# EAGLE design MRA13 (EAGLE 6.5.0)
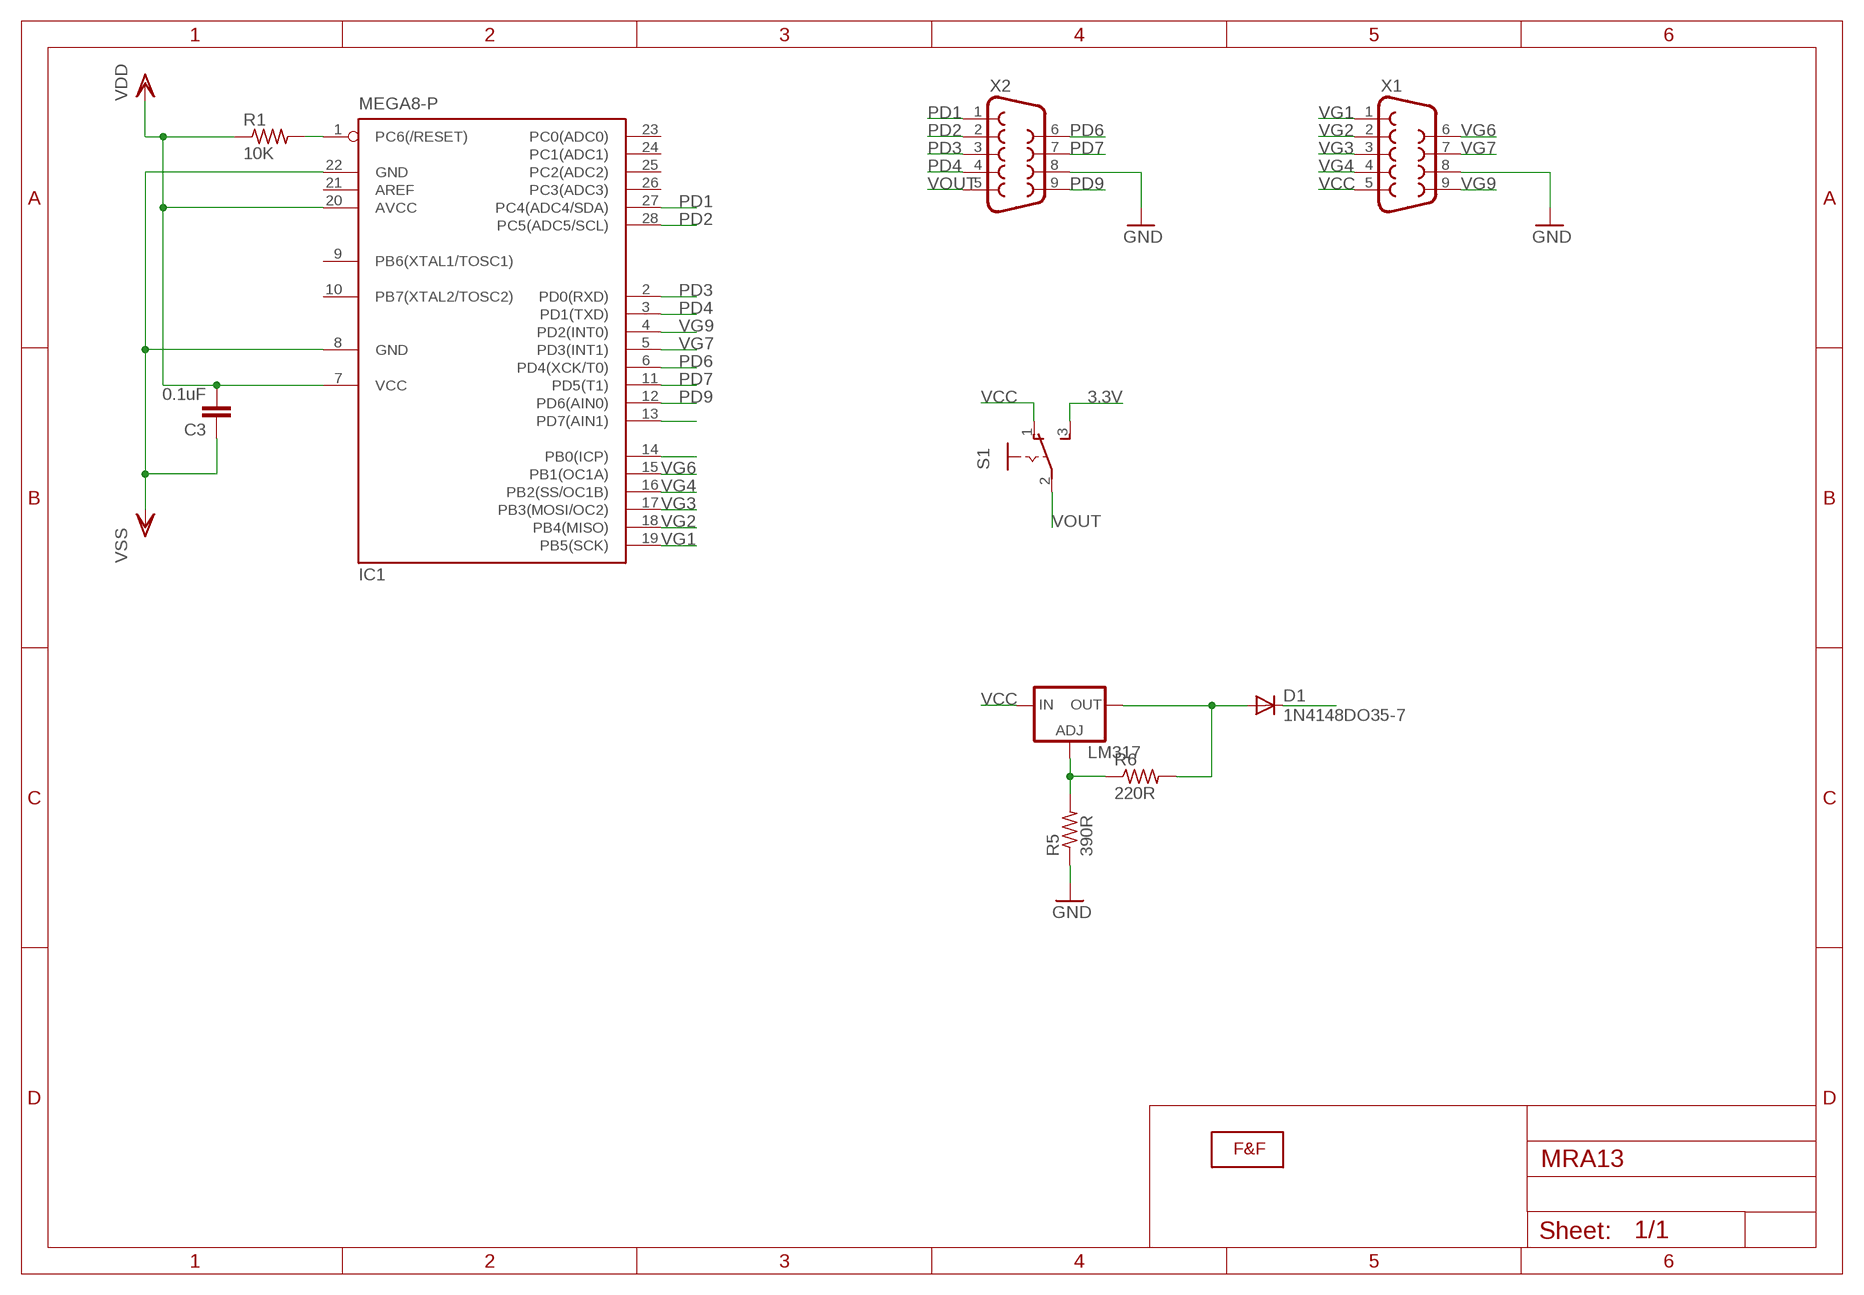
[diagram p0: schematic, sheet 1]

## Parts
C3  0.1uF  C-EU050-024X044  [C050-024X044]
D1  1N4148DO35-7  [DO35-7]
IC1  MEGA8-P  [DIL28-3]
LM317  LM317TS  [317TS]
R1  10K  R-US_0207/10  [0207/10]
R5  390R  R-US_0207/10  [0207/10]
R6  220R  R-US_0207/10  [0207/10]
S1  CHAVE  [CHAVE]
U$1  LOGOLOGO_WITHOUT_SMOKE_SMALL  [LOGO2_SMALL]
X1  DB9MALE  [DB9_MALE]
X2  DB9MALE  [DB9_MALE]

## Nets
3.3V: D1.C S1.3(S)
GND: C3.1 IC1.8(GND) IC1.22(GND) R5.1 X1.8 X2.8 ; supply symbol labelled VSS
N$1: IC1.1(PC6(/RESET)) R1.2
N$2: IC1.13(PD7(AIN1))
N$3: D1.A LM317.2(OUT) R6.2
N$4: IC1.14(PB0(ICP))
N$5: LM317.1(ADJ) R5.2 R6.1
PD1: IC1.27(PC4(ADC4/SDA)) X2.1
PD2: IC1.28(PC5(ADC5/SCL)) X2.2
PD3: IC1.2(PD0(RXD)) X2.3
PD4: IC1.3(PD1(TXD)) X2.4
PD6: IC1.6(PD4(XCK/T0)) X2.6
PD7: IC1.11(PD5(T1)) X2.7
PD9: IC1.12(PD6(AIN0)) X2.9
VCC: LM317.3(IN) S1.1(O) X1.5
VG1: IC1.19(PB5(SCK)) X1.1
VG2: IC1.18(PB4(MISO)) X1.2
VG3: IC1.17(PB3(MOSI/OC2)) X1.3
VG4: IC1.16(PB2(SS/OC1B)) X1.4
VG6: IC1.15(PB1(OC1A)) X1.6
VG7: IC1.5(PD3(INT1)) X1.7
VG9: IC1.4(PD2(INT0)) X1.9
VOUT: C3.2 IC1.7(VCC) IC1.20(AVCC) R1.1 S1.2(P) X2.5 ; supply symbol labelled VDD
Unconnected: IC1.9(PB6(XTAL1/TOSC1)) IC1.10(PB7(XTAL2/TOSC2)) IC1.21(AREF) IC1.23(PC0(ADC0)) IC1.24(PC1(ADC1)) IC1.25(PC2(ADC2)) IC1.26(PC3(ADC3))

## Library data of the parts
C3 = rcl:C-EU: CAPACITOR, European symbol
D1 = diode:1N4148: DIODE high speed (Philips)
IC1 = atmel:MEGA8-P: MICROCONTROLLER 8 Kbytes FLASH, 1 kbytes SRAM, 512 bytes EEPROM, USART, 4-channel 10 bit ADC, 2-channel 8 bit ADC Pin compatible with Atmega48, ATMega88, ATMega168 Source: avr.lbr; OC_FARNELL: unknown; OC_NEWARK: unknown
LM317 = v-reg:LM317TS: VOLTAGE REGULATOR
R1 R5 R6 = adafruit:R-US_: RESISTOR, American symbol
S1 = switch-fef:CHAVE: chave Verificar
U$1 = F&F:LOGO: Faísca e Fumaça Logo faiscaefumaca.com.br
X1 X2 = SparkFun:DB9: DB9 Connector Standard DB9 (D-Sub 9) serial connector. Can be used for CAN bus as well as RS485 and RS232. Footprint production proven. Spark Fun Electronics SKU : PRT-00429

## Board
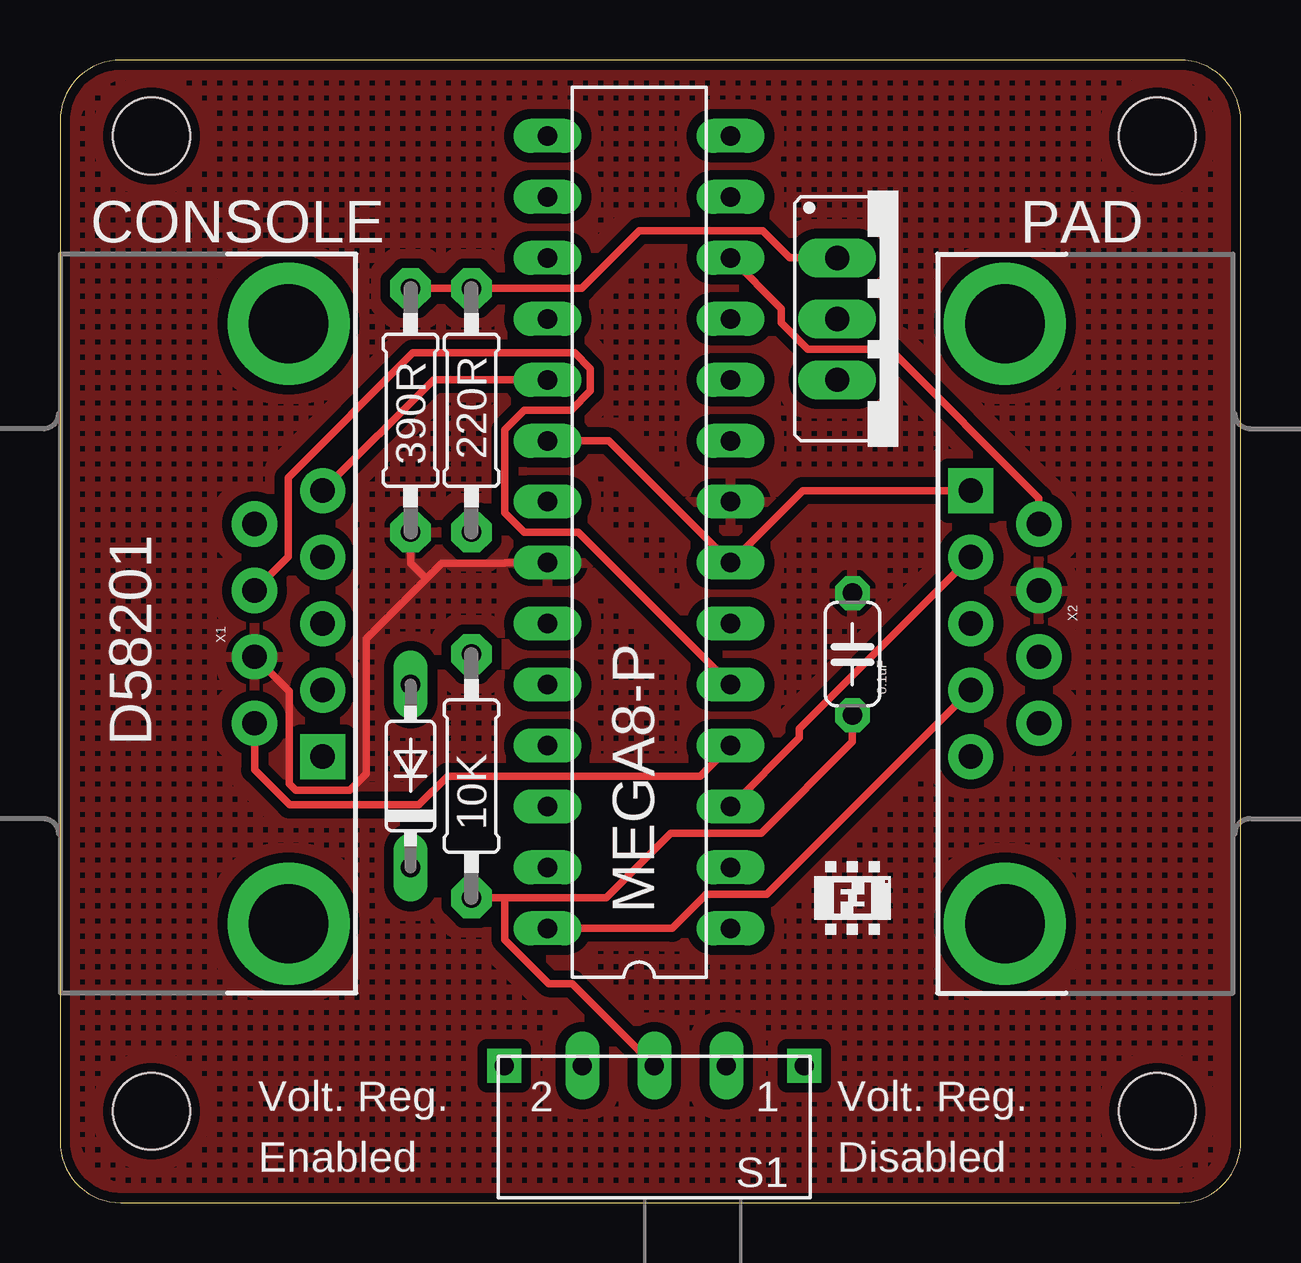
[diagram p1: board, top side]
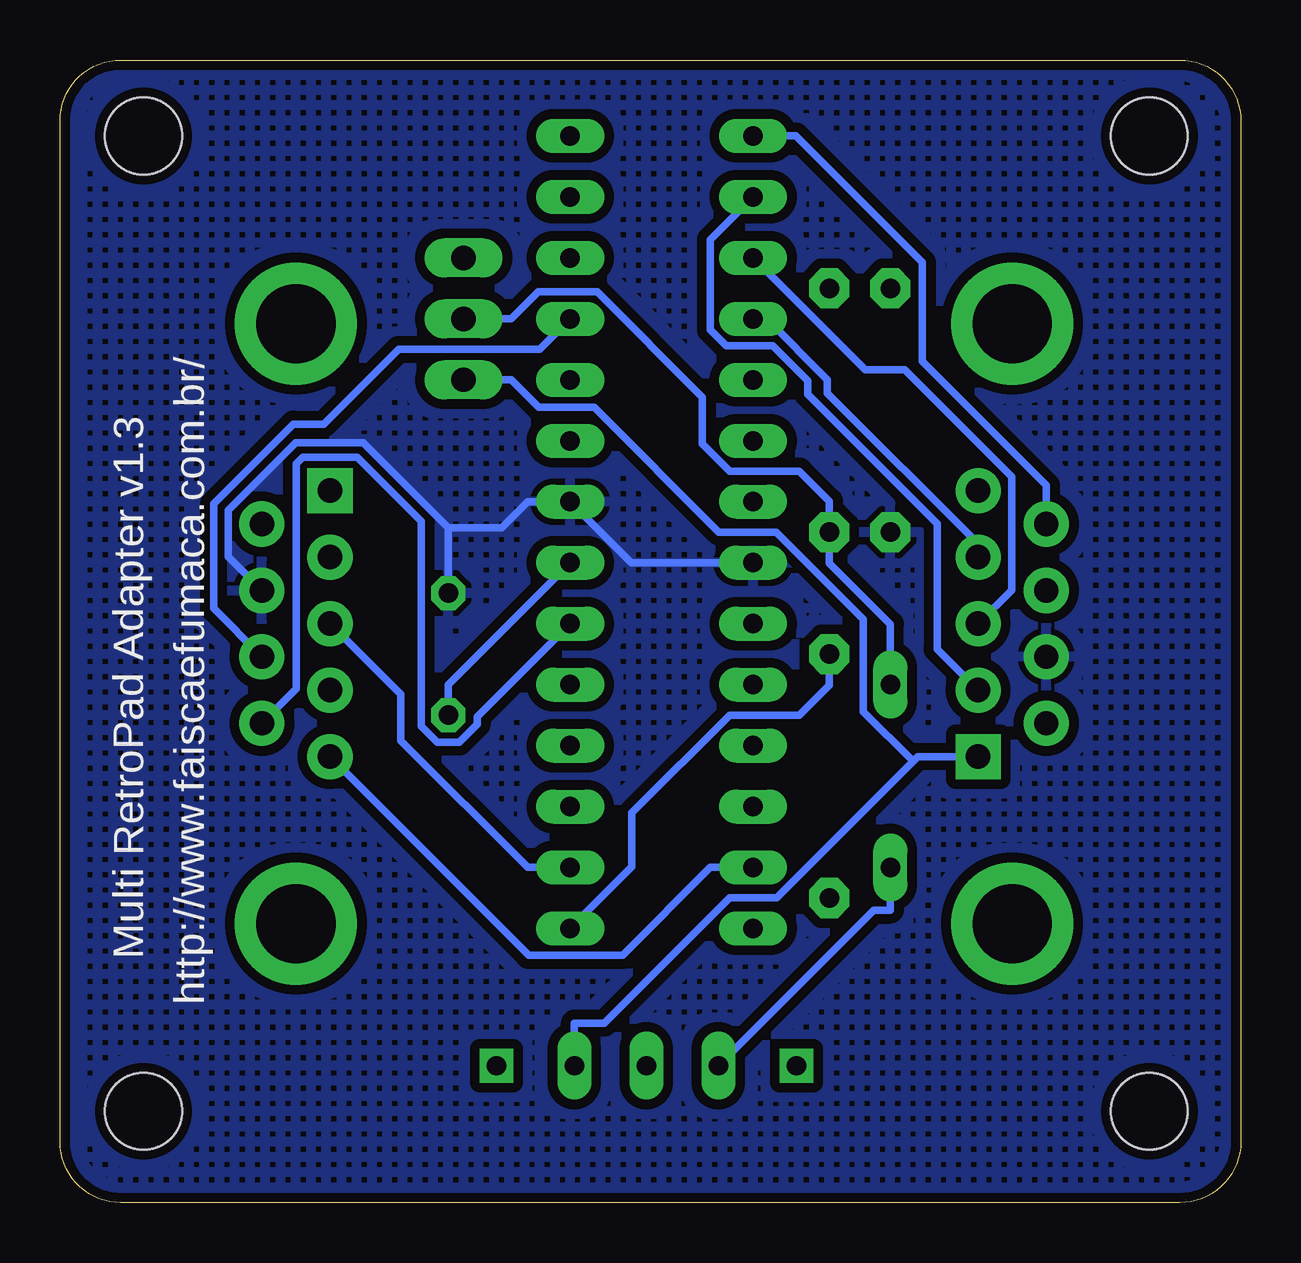
[diagram p2: board, bottom side, seen from below]

Size 49.2 x 47.62 mm. Coordinates in mm from the lower left corner, seen from the top.
Outline: 49.2,45.08 arc90 46.66,47.62 2.54,47.62 arc90 0,45.08 0,2.54 arc90 2.54,0 46.66,0 arc90 49.2,2.54 49.2,45.08
Copper layers (1*16): Top 0.035mm / dielectric 1.5mm / Bottom 0.035mm
Design rules "DFRobot_Eagle_Rule_v0.4": minimum track width 6mil, minimum drill 12mil, track to track 6mil, track to pad 6mil, pad to pad 6mil, via to via 6mil, smd to smd 0mil, copper to edge 10mil, drill to drill 10mil, minimum pad ring 12mil, minimum via ring 8mil, stop-mask expansion 2mil, vias tented up to drill 25mil, thermal gap 10mil
Holes 3.2 mm at 3.81,44.45 3.81,3.81 45.72,44.45 45.72,3.81

### Footprints (pad centres in the part's own frame; a part is rotated, then mirrored left to right if it is on the bottom)
C050-024X044 = drill 0.813 octagon: 1 -2.54,0; 2 2.54,0
DO35-7 = drill 0.813 long: A 3.81,0; C -3.81,0
DIL28-3 = drill 0.813 long: 1 -16.51,-3.81; 2 -13.97,-3.81; 3 -11.43,-3.81; 4 -8.89,-3.81; 5 -6.35,-3.81; 6 -3.81,-3.81; 7 -1.27,-3.81; 8 1.27,-3.81; 9 3.81,-3.81; 10 6.35,-3.81; 11 8.89,-3.81; 12 11.43,-3.81; 13 13.97,-3.81; 14 16.51,-3.81; 15 16.51,3.81; 16 13.97,3.81; 17 11.43,3.81; 18 8.89,3.81; 19 6.35,3.81; 20 3.81,3.81; 21 1.27,3.81; 22 -1.27,3.81; 23 -3.81,3.81; 24 -6.35,3.81; 25 -8.89,3.81; 26 -11.43,3.81; 27 -13.97,3.81; 28 -16.51,3.81
317TS = drill 1.016 long: 1 -2.54,-2.54; 2 0,-2.54; 3 2.54,-2.54
0207/10 = drill 0.813 pad 1.676 octagon: 1 -5.08,0; 2 5.08,0
CHAVE = drill 0.8 long: 1 -3,0; 2 0,0; 3 3,0 | drill 0.8 square: P$1 -6.25,0; P$2 6.25,0
DB9_MALE = drill 1.016 pad 1.88: 1 5.54,-1.42; 2 2.77,-1.42; 3 0,-1.42; 4 -2.77,-1.42; 6 4.15,1.42; 7 1.38,1.42; 8 -1.38,1.42; 9 -4.15,1.42 | drill 1.016 pad 1.88 square: 5 -5.54,-1.42 | drill 3.302 pad 5.08: G1 -12.5,0; G2 12.5,0

### Placement (x,y rotation side)
C3  33.02,22.86 270 top
D1  14.61,17.78 90 top
IC1  24.13,27.94 90 top
LM317  34.92,36.83 270 top
R1  17.14,17.78 90 top
R5  14.61,33.02 90 top
R6  17.14,33.02 270 top
S1  24.77,5.71 180 top
U$1  33.02,12.7 0 top
X1  9.53,24.13 90 top
X2  39.37,24.13 270 top

### Tracks (layer width: path | path; a pad name or v marks a point on that pad's centre or on a via)
3.3V
  Bottom 0.305: D1.C 14.61,12.19 15.29,12.19 S1.3 | S1.3 21.74,5.69 S1.3
GND
  Top 0.305: 15.25,26 12.76,23.5 12.76,17.87 12.08,17.19 9.81,17.19 9.55,17.46 9.55,21.31 X1.8 | X1.8 8.13,22.76 X1.8 | 15.25,26 15.9,26.64 18.52,26.64 18.54,26.67 IC1.22 | 15.25,26 14.61,26.64 R5.1
  Bottom 0.305: 33.02,28.13 C3.1 | 40.86,25.58 X2.8 40.84,25.6 40.86,25.58 | 40.86,25.58 42.19,26.91 42.19,28.86 39.37,31.68 36.56,31.68 33.02,28.13 | 33.02,28.13 30.8,28.13 29.72,29.21 IC1.8 25.4,26.67 IC1.22
  pour Top (isolate 0.406, hatched): 0,48.26 49.53,48.26 49.53,0 0,0
  pour Bottom (isolate 0.406, hatched): 0,48.26 49.53,48.26 49.53,0 0,0
N$1
  Bottom 0.305: R1.2 17.14,21.57 18.39,20.32 21.29,20.32 25.37,16.24 25.37,14 IC1.1
N$3
  Bottom 0.305: D1.A 14.61,24.11 17.14,26.64 R6.2 17.14,29.23 18.39,30.48 21.29,30.48 22.43,31.62 22.43,33.57 26.82,37.95 29.28,37.95 30.4,36.83 LM317.2
N$5
  Top 0.305: R5.2 R6.1 21.74,38.1 24.13,40.49 29.28,40.49 30.4,39.37 LM317.1
PD1
  Bottom 0.305: IC1.27 22.1,13.97 25.76,10.31 29.67,10.31 X2.1 | X2.1 38,18.69 X2.1
PD2
  Top 0.305: X2.2 29.44,12.85 26.92,12.85 25.5,11.43 IC1.28 | X2.2 38,21.34 X2.2
PD3
  Bottom 0.305: X2.3 35,21.18 35,19.25 29.72,13.97 IC1.2 | X2.3 38,24.18 X2.3
PD4
  Top 0.305: X2.4 30.8,19.75 30.8,19.37 IC1.3 | X2.4 38,27.03 X2.4
PD6
  Bottom 0.305: IC1.6 31.82,20.25 31.82,19.94 32.55,19.2 33.48,19.2 34.14,19.85 34.14,28.39 36.82,31.07 39.08,31.07 39.35,30.8 39.35,21.42 X2.6 | X2.6 40.84,19.91 X2.6
PD7
  Bottom 0.305: 40.82,22.78 X2.7 40.84,22.76 40.82,22.78 | 40.82,22.78 42.8,24.76 42.8,29.12 39.48,32.44 38.21,32.44 35.09,35.56 29.21,35.56 IC1.11
PD9
  Top 0.305: X2.9 40.79,29.36 34.59,35.56 31.16,35.56 30.06,36.66 30.06,37.25 IC1.12 | X2.9 40.84,28.25 X2.9
VCC
  Bottom 0.305: 13.65,18.39 19.35,12.7 21.29,12.7 26.51,7.48 27.77,7.48 S1.1 | 10.97,18.59 X1.5 10.97,18.69 10.97,18.59 | 10.97,18.59 13.46,18.59 13.65,18.39 | 13.65,18.39 15.73,20.46 15.73,24.32 19.35,27.94 21.74,27.94 26.95,33.15 29.26,33.15 30.4,34.29 LM317.3 | S1.1 27.84,5.69 S1.1
VG1
  Top 0.305: IC1.19 15.56,34.29 10.96,29.68 | 10.96,29.68 X1.1 10.97,29.67 10.96,29.68
VG2
  Bottom 0.305: IC1.18 19.75,36.83 17.22,34.3 17.22,33.73 10.95,27.45 10.95,27.03 | 10.95,27.03 X1.2 10.97,27.03 10.95,27.03
VG3
  Bottom 0.305: 10.93,24.14 X1.3 10.97,24.18 10.93,24.14 | 10.93,24.14 9.55,25.53 9.55,30.26 14,34.71 15.66,34.71 IC1.17
VG4
  Bottom 0.305: IC1.16 22.1,40.13 22.1,36.37 21.44,35.71 19.5,35.71 18.05,34.26 18.05,33.69 12.65,28.3 12.65,23.07 X1.4 | X1.4 10.97,21.34 X1.4
VG6
  Bottom 0.305: X1.6 8.11,29.89 13.27,35.05 13.27,39.18 18.54,44.45 IC1.15 | X1.6 8.13,28.25 X1.6
VG7
  Top 0.305: 8.16,25.57 X1.7 8.13,25.6 8.16,25.57 | 8.16,25.57 9.5,26.91 9.5,30.21 14.71,35.41 21.44,35.41 22.1,34.75 22.1,33.83 21.29,33.02 19.34,33.02 18.54,32.21 18.54,28.75 19.35,27.94 21.59,27.94 IC1.5
VG9
  Top 0.305: 8.11,19.91 X1.9 8.13,19.91 8.11,19.91 | 8.11,19.91 8.11,18.04 9.56,16.58 14.96,16.58 16.16,17.78 26.67,17.78 IC1.4
VOUT
  Top 0.305: IC1.20 22.86,31.75 IC1.7 30.94,29.67 X2.5 | 18.54,12.7 R1.1 | 18.54,12.7 22.75,12.7 25.45,15.39 29.21,15.39 33.02,19.2 C3.2 | 18.54,12.7 18.54,10.97 20.37,9.13 21.35,9.13 S1.2 | X2.5 38,29.67 X2.5
  Bottom 0.305: IC1.7 33.02,21.59 C3.2

### Text on the board
tPlace: CONSOLE | PAD | D58201 | Volt. Reg. | Volt. Reg. | Enabled | Disabled
bPlace: Multi RetroPad Adapter v1.3 | http://www.faiscaefumaca.com.br/